# EAGLE design EnvironmentMonitorV5.1 (EAGLE 7.4.0)
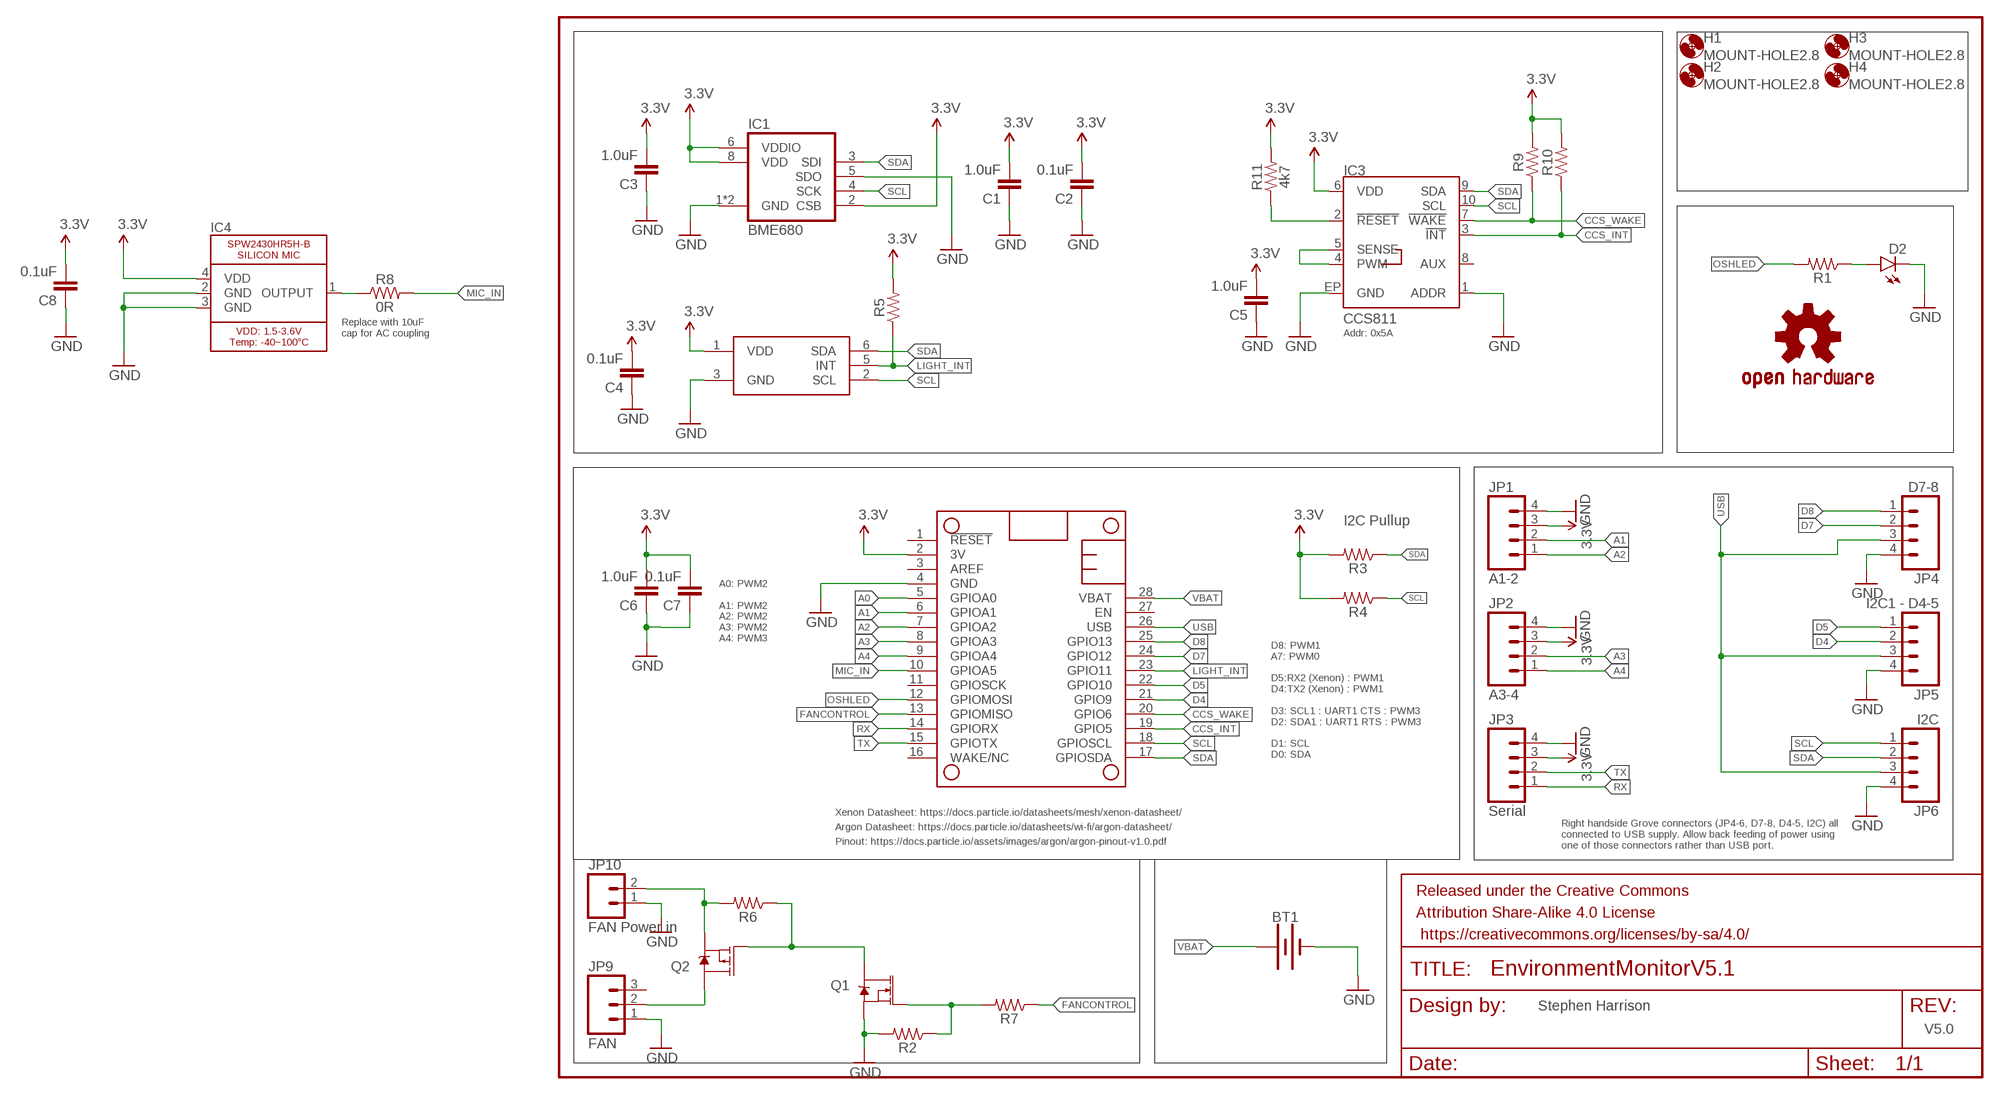
[diagram p0: schematic, sheet 1]

## Parts
BT1  BATTERY-16340  [BATTERY_16340-HOLDER]
C1  1.0uF  1.0UF-25V-+80/-20(0805)"  [0805-CAP]
C2  0.1uF  1.0UF-25V-+80/-20(0805)"  [0805-CAP]
C3  1.0uF  1.0UF-25V-+80/-20(0805)"  [0805-CAP]
C4  0.1uF  1.0UF-25V-+80/-20(0805)"  [0805-CAP]
C5  1.0uF  1.0UF-25V-+80/-20(0805)"  [0805-CAP]
C6  1.0uF  1.0UF-25V-+80/-20(0805)"  [0805-CAP]
C7  0.1uF  1.0UF-25V-+80/-20(0805)"  [0805-CAP]
C8  0.1uF  1.0UF-25V-+80/-20(0805)"  [0805-CAP]
D2  LED1206-BOTTOM  [LED-1206-BOTTOM]
FRAME1  FRAME-LETTER  [CREATIVE_COMMONS]
H1  MOUNT-HOLE2.8  [2,8]
H2  MOUNT-HOLE2.8  [2,8]
H3  MOUNT-HOLE2.8  [2,8]
H4  MOUNT-HOLE2.8  [2,8]
IC1  BME680  [BME680]
IC2  TCS3472  [FN-6]
IC3  CCS811  [LGA10]
IC4  SPW2430HR5H-B  [SPW2430HR5H-B]
IC5  FEATHERWING_NODIM  [FEATHERWING_DIM]
JP1  A1-2  M04JST-PTH-VERT  [JST-4-PTH-VERT]
JP2  A3-4  M04JST-PTH-VERT  [JST-4-PTH-VERT]
JP3  Serial  M04JST-PTH-VERT  [JST-4-PTH-VERT]
JP4  D7-8  M04JST-PTH-VERT  [JST-4-PTH-VERT]
JP5  I2C1 - D4-5  M04JST-PTH-VERT  [JST-4-PTH-VERT]
JP6  I2C  M04JST-PTH-VERT  [JST-4-PTH-VERT]
JP9  FAN  M03POLAR  [MOLEX-1X3]
JP10  FAN Power in  M02POLAR_LOCK  [MOLEX-1X2_LOCK]
LOGO1  OSHW-LOGOM  [OSHW-LOGO-M]
Q1  220mA/50V/3.5Ω  MOSFET-NCH-BSS138  [SOT23-3]
Q2  4.3A/20V/54mΩ  MOSFET_PCH-IRLML2244  [SOT23-3]
R1  RESISTOR0805  [0805]
R2  RESISTOR0805  [0805]
R3  RESISTOR0805  [0805]
R4  RESISTOR0805  [0805]
R5  RESISTOR0805  [0805]
R6  RESISTOR0805  [0805]
R7  RESISTOR0805  [0805]
R8  0R  RESISTOR0805  [0805]
R9  RESISTOR0805  [0805]
R10  RESISTOR0805  [0805]
R11  4k7  RESISTOR0805  [0805]

## Nets
3.3V: C1.2 C2.2 C3.2 C4.2 C5.2 C6.2 C7.2 C8.2 IC1.2(CSB) IC1.6(VDDIO) IC1.8(VDD) IC2.1(VDD) IC3.6(VDD) IC4.4(VDD) IC5.2(3V) JP1.3 JP2.3 JP3.3 R3.2 R4.2 R5.2 R9.2 R10.2 R11.2
A0: IC5.5(GPIOA0)
A1: IC5.6(GPIOA1) JP1.2
A2: IC5.7(GPIOA2) JP1.1
A3: IC5.8(GPIOA3) JP2.2
A4: IC5.9(GPIOA4) JP2.1
CCS8_RESET: IC3.2(!RESET!) R11.1
CCS_INT: IC3.3(!INT!) IC5.19(GPIO5) R10.1
CCS_WAKE: IC3.7(!WAKE!) IC5.20(GPIO6) R9.1
D4: IC5.21(GPIO9) JP5.2
D5: IC5.22(GPIO10) JP5.1
D7: IC5.24(GPIO12) JP4.2
D8: IC5.25(GPIO13) JP4.1
FANCONTROL: IC5.13(GPIOMISO) R7.1
GND: BT1.P$2(-) C1.1 C2.1 C3.1 C4.1 C5.1 C6.1 C7.1 C8.1 D2.C IC1.1(GND) IC1.5(SDO) IC1.7(GND) IC2.3(GND) IC3.1(ADDR) IC3.EP(GND) IC4.2(GND) IC4.3(GND) IC5.4(GND) JP1.4 JP2.4 JP3.4 JP4.4 JP5.4 JP6.4 JP9.1 JP10.1 Q1.2(S) R2.2
LIGHT_INT: IC2.5(INT) IC5.23(GPIO11) R5.1
MIC_IN: IC5.10(GPIOA5) R8.2
N$1: JP10.2 Q2.2(S) R6.2
N$2: Q1.3(D) Q2.1(G) R6.1
N$3: IC3.4(PWM) IC3.5(SENSE)
N$5: Q1.1(G) R2.1 R7.2
N$6: D2.A R1.1
N$7: IC4.1(OUTPUT) R8.1
N$8: JP9.2 Q2.3(D)
OSHLED: IC5.12(GPIOMOSI) R1.2
RX: IC5.14(GPIORX) JP3.1
SCL: IC1.4(SCK) IC2.2(SCL) IC3.10(SCL) IC5.18(GPIOSCL) JP6.1 R4.1
SDA: IC1.3(SDI) IC2.6(SDA) IC3.9(SDA) IC5.17(GPIOSDA) JP6.2 R3.1
TX: IC5.15(GPIOTX) JP3.2
USB: IC5.26(USB) JP4.3 JP5.3 JP6.3
VBAT: BT1.P$1(+) IC5.28(VBAT)
Unconnected: IC3.8(AUX) IC5.1(!RESET) IC5.3(AREF) IC5.11(GPIOSCK) IC5.16(WAKE/NC) IC5.27(EN) JP9.3

## Notes on the sheet
- Replace with 10uF 
  cap for AC coupling
- Addr: 0x5A
- I2C Pullup
- A0: PWM2
  
  A1: PWM2
  A2: PWM2
  A3: PWM2
  A4: PWM3
- D8: PWM1
  A7: PWM0
  
  D5:RX2 (Xenon) : PWM1
  D4:TX2 (Xenon) : PWM1
  
  D3: SCL1 : UART1 CTS : PWM3
  D2: SDA1 : UART1 RTS : PWM3
  
  D1: SCL
  D0: SDA
- Xenon Datasheet: https://docs.particle.io/datasheets/mesh/xenon-datasheet/
- Argon Datasheet: https://docs.particle.io/datasheets/wi-fi/argon-datasheet/
- Pinout: https://docs.particle.io/assets/images/argon/argon-pinout-v1.0.pdf
- Right handside Grove connectors (JP4-6, D7-8, D4-5, I2C) all 
  connected to USB supply. Allow back feeding of power using
  one of those connectors rather than USB port.
- Stephen Harrison
- V5.0

## Library data of the parts
BT1 = ThingySticks:BATTERY: Battery - Single Cell A variety of battery chemistries, sizes, and footprints. Device List: 20MM_PTH - Coin Cell Battery Holder - 20mm (PTH) <https://www.sparkfun.com/products/783> 12MM_SMD - Coin Cell Battery Holder - 12mm (SMD) <https://www.sparkfun.com/products/10592> 12MM_PTH - Coin Cell Battery Holder - 12mm (PTH) <https://www.sparkfun.com/products/7948> 20MM_SMD - 20mm Coin Cell Battery Holder (SMD) (2 legs) Used on the Big Time Watch Kit <https://www.sparkfun.com/products/11734> 20MM_SMD_4LEGS - Coin Cell Battery Holder - 20mm (SMD) <https://www.sparkfun.com/products/11892> 20MM_SMD_4LEGS_OVERPASTE - Coin Cell Battery Holder - 20mm (SMD) <https://www.sparkfun.com/products/11892> (Over-paste on the legs) 24.5MM_PTH - Coin Cell Battery Holder - 24.5mm (PTH) <https://www.sparkfun.com/products/8863> 9V - 9V Battery Holder - PC Mount Used on the SparkFun SparkPunk Sound Kit <https://www.sparkfun.com/products/11177> and SparkFun SparkPunk Sequencer Kit <https://www.sparkfun.com/products/12707> 18650 - Battery Holder - 18650 (PTH) <https://www.sparkfun.com/products/13113> AA - Battery Holder - 1xAA (PTH) <https://www.sparkfun.com/products/7949> AAA - Battery Holder - 1xAAA (PTH) <https://www.sparkfun.com/products/12718> AA_KIT - Battery Holder - 1xAA (PTH) <https://www.sparkfun.com/products/7949> Special kit package - pads only have exposed copper on one side of the board. AAA_KIT - Battery Holder - 1xAAA (PTH) <https://www.sparkfun.com/products/12718> Special kit package - pads only have exposed copper on one side of the board.
C1 C3 C5 C6 = SparkFun-Capacitors:1.0UF-25V-+80/-20(0805): CAP-11625; PROD_ID: CAP-11625
C2 C4 C7 C8 = SparkFun-Capacitors:1.0UF-25V-+80/-20(0805): CAP-11625; PROD_ID: CAP-11625; VALUE: 1.0uF
D2 = SparkFun-LED:LED: LEDs Standard schematic elements and footprints for 5mm, 3mm, 1206, and 0603 sized LEDs. 5mm - Spark Fun Electronics SKU : COM-00529 (and others)
FRAME1 = SparkFun-Aesthetics:FRAME-LETTER: Schematic Frame Standard 8.5x11 US Letter frame
H1-H4 = holes:MOUNT-HOLE: MOUNTING HOLE with drill center marker
IC1 = ThingySticks:BME680: BME680 integrates for the first time individual high linearity and high accuracy sensors for gas, pressure, humidity and temperature. The library has been designed by Richard Magdycz <https://www.facebook.com/groups/eaglecadsoftUK> Original version had pins in incorrect places (BME680 uses untypical clockwise direction). Updated 17 Feb 2018 S.Harrison ThingySticks.com
IC2 = TCS3472:TCS3472
IC3 = ThingySticks:CCS811: AMS CCS811 – I2C Digital Gas Sensor Ultra-Low Power Digital Gas Sensor for Monitoring Indoor Air Quality AMS Product Page <http://ams.com/eng/Products/Environmental-Sensors/Gas-Sensors/CCS811> SparkFun Products:; PROD_ID: IC-13607
IC4 = microbuilder:SPW2430HR5H-B: SPW2430HR5H-B - Silicon Microphone
IC5 = ThingySticks:FEATHERWING
JP1 = SparkFun-Connectors:M04: Header 4 Standard 4-pin 0.1" header. Use with straight break away headers (SKU : PRT-00116), right angle break away headers (PRT-00553), swiss pins (PRT-00743), machine pins (PRT-00117), and female headers (PRT-00115). Molex polarized connector foot print use with SKU : PRT-08231 with associated crimp pins and housings. 1MM SMD Version SKU: PRT-10208; CPC: MK00368; SEEEDSTUDIO: 110990030
JP2-JP6 = SparkFun-Connectors:M04: Header 4 Standard 4-pin 0.1" header. Use with straight break away headers (SKU : PRT-00116), right angle break away headers (PRT-00553), swiss pins (PRT-00743), machine pins (PRT-00117), and female headers (PRT-00115). Molex polarized connector foot print use with SKU : PRT-08231 with associated crimp pins and housings. 1MM SMD Version SKU: PRT-10208
JP9 = SparkFun-Connectors:M03: Header 3 Standard 3-pin 0.1" header. Use with straight break away headers (SKU : PRT-00116), right angle break away headers (PRT-00553), swiss pins (PRT-00743), machine pins (PRT-00117), and female headers (PRT-00115). Molex polarized connector foot print use with SKU : PRT-08232 with associated crimp pins and housings.
JP10 = SparkFun-Connectors:M02: Standard 2-pin 0.1" header. Use with - straight break away headers ( PRT-00116) - right angle break away headers (PRT-00553) - swiss pins (PRT-00743) - machine pins (PRT-00117) - female headers (PRT-00115) Molex polarized connector foot print use with: PRT-08233 with associated crimp pins and housings. 2.54_SCREWTERM for use with PRT-10571. 3.5mm Screw Terminal footprints for PRT-08084 5mm Screw Terminal footprints for use with PRT-08432
LOGO1 = SparkFun-Aesthetics:OSHW-LOGO: Open Source Hardware Logo This logo indicates the piece of hardware it is found on incorporates a OSHW license and/or adheres to the definition of open source hardware found here: http://freedomdefined.org/OSHW
Q1 = SparkFun-DiscreteSemi:MOSFET-NCH: N-channel MOSFETs Voltage controlled devices that allow control of high current outputs. SparkFun Products: SparkFun OpenScale <https://www.sparkfun.com/products/13261> SparkFun Digital Sandbox <https://www.sparkfun.com/products/12651> SparkFun Monster Moto Shield <https://www.sparkfun.com/products/10182> SparkFun MOSFET Power Controller <https://www.sparkfun.com/products/11214>; PROD_ID: TRANS-00830
Q2 = SparkFun-DiscreteSemi:MOSFET_PCH: P-channel MOSFETs Voltage controlled devices that allow control of high current outputs. SparkFun Products: SparkFun ESP32 Thing <https://www.sparkfun.com/products/13907> SparkFun ESP8266 Thing <https://www.sparkfun.com/products/13231>; PROD_ID: TRANS-11153
R1-R11 = SparkFun-Resistors:RESISTOR: Generic Resistor Package

## Board
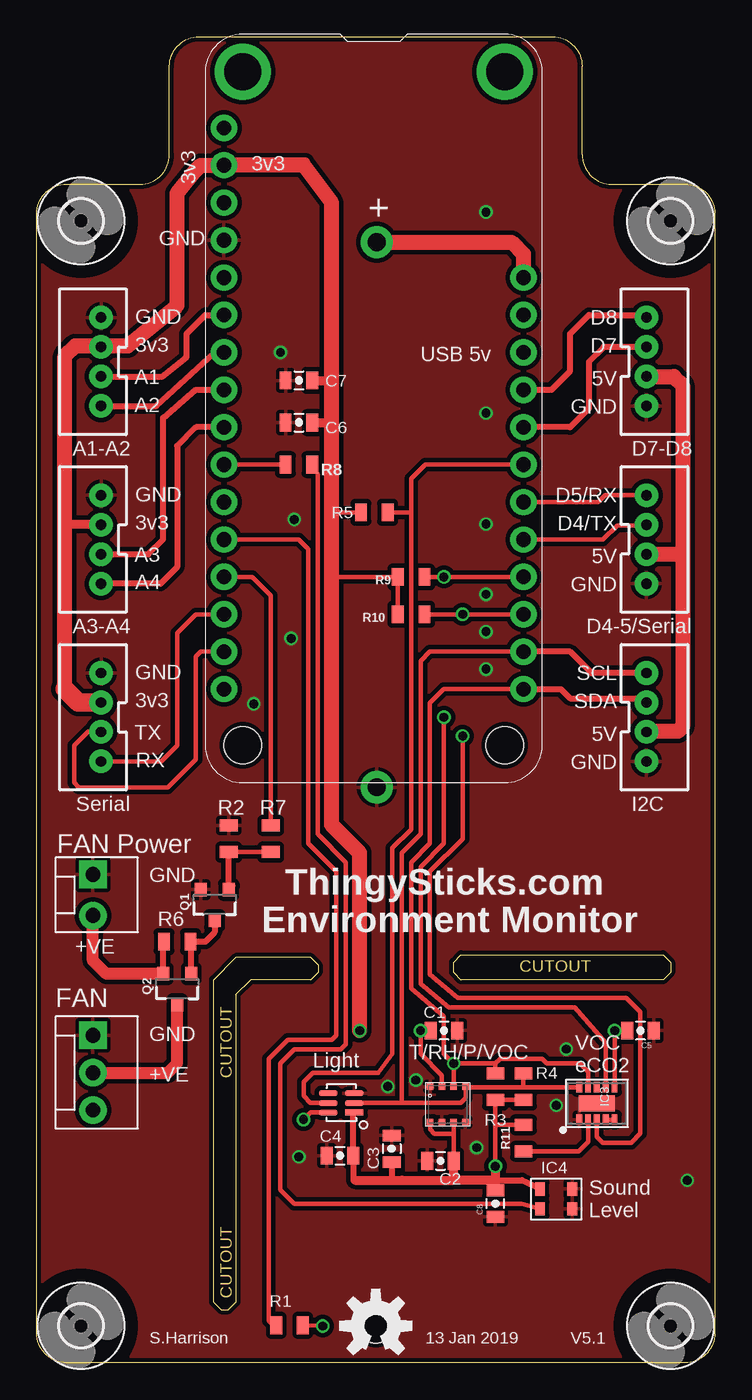
[diagram p1: board, top side]
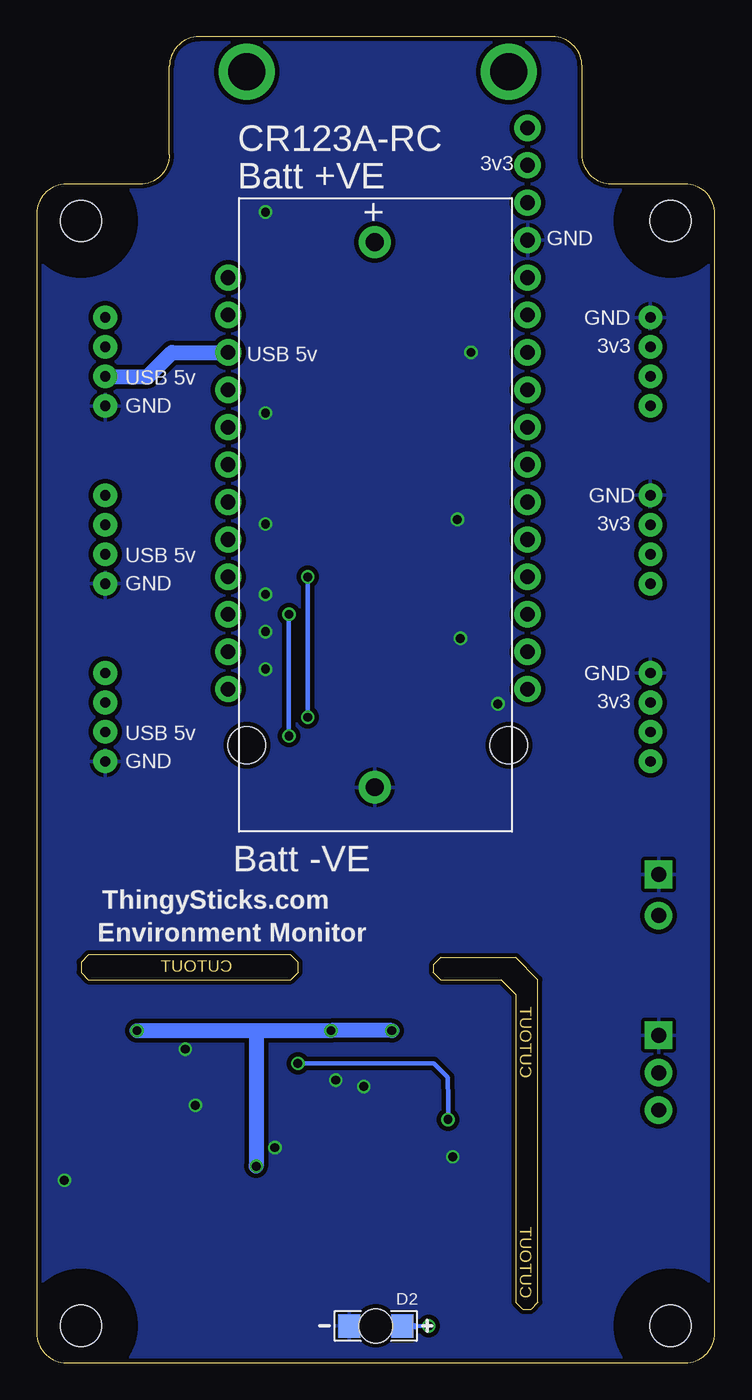
[diagram p2: board, bottom side, seen from below]

Size 46 x 90 mm. Coordinates in mm from the lower left corner, seen from the top.
Outline: 0,2 0,78 arc-90 2,80 7,80 arc90 9,82 9,88 arc-90 11,90 35,90 arc-90 37,88 37,82 arc90 39,80 44,80 arc-90 46,78 46,2 arc-90 44,0 2,0 arc-90 0,2
Outline: 12,4.1 12,26 13.5,27.5 18.59,27.5 19.09,27 19.09,26.5 18.59,26 14.5,26 13.5,25 13.5,4.1 13,3.6 12.5,3.6 12,4.1
Outline: 28.78,27.68 42.5,27.68 43,27.18 43,26.5 42.5,26 28.78,26 28.28,26.5 28.28,27.18 28.78,27.68
Copper layers (1*16): Top 0.035mm / dielectric 1.5mm / Bottom 0.035mm
Design rules "dirt_cheap_dirty_boards.v1": minimum track width 5mil, minimum drill 12mil, track to track 5mil, track to pad 5mil, pad to pad 5mil, via to via 5mil, smd to smd 0mil, copper to edge 10mil, drill to drill 10mil, minimum pad ring 10mil, minimum via ring 6mil, stop-mask expansion 2mil, vias tented up to drill 25mil, thermal gap 10mil

### Footprints (pad centres in the part's own frame; a part is rotated, then mirrored left to right if it is on the bottom)
BATTERY_16340-HOLDER = drill 1.2 pad 2.184: P$1 3,9.2; P$2 40,9.2
0805-CAP = smd 0.8 x 1.2: 1 -0.9,0; 2 0.9,0
LED-1206-BOTTOM = smd 1.5 x 1.6: A -1.8,0; C 1.8,0 | hole 2.3: 0,0
2,8 = hole 2.8: 0,0
BME680 = smd 0.45 x 0.45: 1 1.2,-1.2; 2 0.4,-1.2; 3 -0.4,-1.2; 4 -1.2,-1.2; 5 -1.2,1.2; 6 -0.4,1.2; 7 0.4,1.2; 8 1.2,1.2
FN-6 = smd 1.25 x 0.4: 1 -0.875,0.65; 2 -0.875,0; 3 -0.875,-0.65; 4 0.875,-0.65; 5 0.875,0; 6 0.875,0.65
LGA10 = smd 0.7 x 0.4: 1 -1.1,1.2; 2 -1.1,0.6; 3 -1.1,0; 4 -1.1,-0.6; 5 -1.1,-1.2; 6 1.1,-1.2; 7 1.1,-0.6; 8 1.1,0; 9 1.1,0.6; 10 1.1,1.2 | smd 1.1 x 2.45: EP 0,0
SPW2430HR5H-B = smd 0.9 x 0.66: 1 -0.675,1.095; 2 -0.675,-1.095; 3 0.675,-1.095; 4 0.675,1.095
FEATHERWING_DIM = drill 1 pad 1.778: 1 6.35,1.27; 2 8.89,1.27; 3 11.43,1.27; 4 13.97,1.27; 5 16.51,1.27; 6 19.05,1.27; 7 21.59,1.27; 8 24.13,1.27; 9 26.67,1.27; 10 29.21,1.27; 11 31.75,1.27; 12 34.29,1.27; 13 36.83,1.27; 14 39.37,1.27; 15 41.91,1.27; 16 44.45,1.27; 17 44.45,21.59; 18 41.91,21.59; 19 39.37,21.59; 20 36.83,21.59; 21 34.29,21.59; 22 31.75,21.59; 23 29.21,21.59; 24 26.67,21.59; 25 24.13,21.59; 26 21.59,21.59; 27 19.05,21.59; 28 16.51,21.59 | drill 2.5 pad 3.81: P$1 2.54,20.32; P$2 2.54,2.54 | hole 2.54: 48.26,20.32; 48.26,2.54
JST-4-PTH-VERT = drill 0.7 pad 1.6: 1 -3,-0.55; 2 -1,-0.55; 3 1,-0.55; 4 3,-0.55
MOLEX-1X3 = drill 1.016 pad 1.88 square: 1 0,0 | drill 1.016 pad 1.88: 2 2.54,0; 3 5.08,0
MOLEX-1X2_LOCK = drill 1.016 pad 1.88 square: 1 -0.127,0 | drill 1.016 pad 1.88: 2 2.667,0
SOT23-3 = smd 0.8 x 0.9: 1 -0.95,-1; 2 0.95,-1; 3 0,1.1
0805 = smd 0.8 x 1.2: 1 -0.9,0; 2 0.9,0

### Placement (x,y rotation side)
BT1  32.27,79.06 270 bottom
C1  27.62,22.54 180 top
C2  27.39,13.7 0 top
C3  24.08,14.52 270 top
C4  20.57,14.05 0 top
C5  40.96,22.54 180 top
C6  17.78,63.82 0 top
C7  17.78,66.67 0 top
C8  31.11,10.79 90 top
D2  23,2.5 180 bottom
FRAME1  -2.54,-23.5 0 top  (outside the outline)
H1  3,2.5 0 top
H2  3,77.5 0 top
H3  43,2.5 0 top
H4  43,77.5 0 top
IC1  27.89,17.53 180 top
IC2  20.66,17.64 180 top
IC3  38,17.6 90 top
IC4  35.24,11.11 90 top
IC5  11.43,90.17 270 top
JP1  3.81,67.94 90 top
JP2  3.81,55.88 90 top
JP3  3.81,43.81 90 top
JP4  41.91,67.94 270 top
JP5  41.91,55.88 270 top
JP6  41.91,43.81 270 top
JP9  3.81,22.23 270 top
JP10  3.81,33.02 270 top
LOGO1  23,2.5 0 top
Q1  12.06,31.11 180 top
Q2  9.53,25.4 180 top
R1  17.14,2.54 180 top
R2  13.02,35.56 90 top
R3  31.11,18.73 270 top
R4  33.02,18.73 270 top
R5  22.9,57.72 180 top
R6  9.53,28.57 180 top
R7  15.88,35.56 270 top
R8  17.78,60.96 180 top
R9  25.4,53.34 180 top
R10  25.4,50.8 180 top
R11  33.02,15.24 90 top

### Tracks (layer width: path | path; a pad name or v marks a point on that pad's centre or on a via)
3.3V  (via drill 0.6)
  Top 0.305: 27.43,18.78 IC1.2 27.48,19.5 26.04,20.95 26.04,22.49 C1.2 | C2.2 28.29,15.54 | 28.29,15.54 IC1.6 | IC1.8 26.68,15.84 26.98,15.54 28.29,15.54 | 31.11,16.19 R3.2 R4.2 | 31.11,16.19 v31.11,13.34 | IC3.6 39.2,22.38 v39.2,22.54 C5.2 | R11.2 31.17,16.14 31.11,16.19 | R10.2 R9.2 20,53.34 | R5.2 20.39,57.72 20,62.23
  Top 0.406: IC2.1 21.48,16.92 C4.2 21.48,12.5 21.59,12.38 | C3.2 24.08,12.43 24.77,12.38 | C1.2 v26.04,22.54 | 31.11,12.38 32.92,12.38 IC4.4
  Top 0.61: 21.59,12.38 24.77,12.38 28.26,12.38 | JP2.3 2.02,56.88 1.91,57 | 18.22,81.5 18,81.28 | C6.2 20,63.82 | C7.2 20,66.67 | v31.11,13.34 31.11,12.38 | 31.11,12.38 C8.2 | 31.11,12.38 28.26,12.38 | C2.2 28.26,13.7 28.26,12.38
  Top 1.016: 1.91,45.72 1.91,57 1.91,68.35 2.59,69.04 4.27,69.04 | 4.27,69.04 JP1.3 | 4.27,69.04 6.17,69.04 9.53,71.75 9.53,79.38 10.79,80.96 11.11,81.28 IC5.2 18,81.28 18.1,81.28 20,78.74 20,66.67 20,63.82 20,62.23 20,53.34 20,36.51 21.91,34.61 v21.91,22.54
  Top 1.27: JP3.3 2.81,44.81 1.91,45.72
  Bottom 1.016: v39.2,22.54 31.11,22.54 | 31.11,22.54 v26.04,22.54 v21.91,22.54 | 31.11,22.54 v31.11,13.34
A1
  Top 0.406: JP1.2 8.53,66.94 10.16,68.26 10.16,69.85 11.43,71.12 IC5.6
A2
  Top 0.406: JP1.1 8.11,64.94 12.06,68.58 IC5.7
A3
  Top 0.406: JP2.2 7.57,54.88 8.57,55.88 8.57,64.14 10.79,66.04 IC5.8
A4
  Top 0.406: IC5.9 10.79,63.5 9.53,62.23 9.53,54 8.41,52.88 JP2.1
CCS8_RESET
  Top 0.305: IC3.2 37.41,14.98 36.76,14.34 R11.1
CCS_INT  (via drill 0.6)
  Top 0.305: IC3.3 38.01,15.34 38.42,14.92 40.32,14.92 40.96,15.56 40.96,23.81 40.01,24.77 28.57,24.77 26.67,26.35 26.67,33.34 28.89,35.56 v28.89,42.55 | R10.1 v28.89,50.8 IC5.19
  Bottom 0.305: v28.89,42.55 v28.89,50.8
CCS_WAKE  (via drill 0.6)
  Top 0.305: IC3.7 38.6,21.72 36.51,24.13 27.94,24.13 26.04,25.72 26.04,33.66 27.62,35.24 v27.62,43.81 | R9.1 v27.62,53.34 IC5.20
  Bottom 0.305: v27.62,43.81 v27.62,53.34
D4
  Top 0.305: IC5.21 38.42,55.88 39.37,56.83 41.31,56.83 JP5.2
D5
  Top 0.305: JP5.1 38.56,58.88 38.1,58.42 IC5.22
D7
  Top 0.406: JP4.2 38.47,68.94 37.47,67.94 37.47,64.77 36.2,63.5 IC5.24
D8
  Top 0.406: IC5.25 34.92,66.04 36.2,67.31 36.2,69.85 37.47,71.12 41.19,71.12 JP4.1
FANCONTROL
  Top 0.305: R7.1 15.88,52.07 14.61,53.34 IC5.13
GND  (via drill 0.6)
  other vias: 17.78,13.97 25.72,19.18 44.13,12.38 30.48,64.45 23.81,18.75 16.54,68.58 30.48,47.08 14.72,44.72 30.48,78.11 30.48,52.16 29.84,14.61 17.26,49.17 35.93,21.29 30.48,56.92 17.46,57.24 35.24,17.46 30.48,49.62
  pour Bottom (isolate 0.305, rank 6): 46.52,91.19 46.62,-1.44 -0.94,-1.44 -0.73,91.19
  pour Top (isolate 0.305, rank 6): -0.73,91.19 46.52,91.15 46.62,-1.47 -0.94,-1.44
LIGHT_INT
  Top 0.305: IC2.5 18.56,17.64 18.1,18.1 18.1,19.05 18.73,19.68 23.18,19.68 24.13,20.95 24.13,34.92 25.4,36.2 25.4,57.47 25.4,57.72 | 25.4,57.72 25.4,60.01 26.35,60.96 IC5.23 | R5.1 25.4,57.72
MIC_IN
  Top 0.305: IC5.10 R8.2
N$1
  Top 0.406: Q2.2 8.57,28.52 R6.2
  Top 0.813: Q2.2 4.71,26.4 3.81,27.3 JP10.2
N$2
  Top 0.406: Q2.1 10.47,28.52 R6.1 11.43,28.57 12.06,29.21 Q1.3
N$3
  Top 0.305: IC3.4 IC3.5
N$5
  Top 0.305: R7.2 R2.1
  Top 0.406: 13.29,32.38 Q1.1 13.02,34.87 R2.1
N$6  (via drill 0.6)
  Top 0.305: R1.1 19.43,2.52
  Top 0.406: 19.43,2.52 v19.41,2.49
  Bottom 0.305: v19.41,2.49 20.32,2.47
  Bottom 0.406: 20.32,2.47 D2.A
N$7
  Top 0.305: R8.1 19.05,60.33 19.05,35.88 20.95,33.97 20.95,21.59 20.64,21.27 17.46,21.27 16.51,20.32 16.51,11.75 17.46,10.79 32.92,10.79 IC4.1
N$8
  Top 0.813: JP9.2 8.89,19.68 9.53,20.32 Q2.3
OSHLED
  Top 0.305: R1.2 16.06,2.54 15.74,2.86 15.74,20.64 17.01,21.91 20,21.91 20.32,22.23 20.32,33.34 18.41,35.24 18.41,55.24 17.78,55.88 IC5.12
RX
  Top 0.305: JP3.1 8.43,40.81 9.53,41.91 9.53,49.53 10.79,50.8 IC5.14
SCL
  Top 0.305: 24.77,17.64 24.77,34.61 26.04,35.88 26.04,47.62 26.67,48.26 IC5.18 | IC3.10 33.02,18.69 | 33.02,18.69 29.12,18.69 IC1.4 29.11,18.71 29.11,17.98 28.76,17.64 24.77,17.64 | IC2.2 24.77,17.64 | R4.1 33.02,18.69
  Top 0.406: JP6.1 37.64,46.81 36.2,48.26 IC5.18
SDA  (via drill 0.6)
  Top 0.305: IC5.17 27.62,45.72 26.67,44.77 26.67,35.24 25.4,33.97 25.4,25.4 27.62,23.5 27.62,20.95 28.29,20.29 IC1.3 | IC2.6 18.57,16.98 v18.1,16.51 | IC3.9 37.41,19.75 36.83,20.32 34.61,20.32 34.29,20.64 31.43,20.64 31.11,20.32 | 31.11,20.32 v28.29,20.32 | R3.1 31.11,20.32
  Top 0.406: IC5.17 35.56,45.72 36.2,45.09 41.09,45.09 JP6.2 | 28.29,20.29 v28.29,20.32
  Bottom 0.305: v18.1,16.51 18.1,17.78 18.13,19.37 19.08,20.32 v28.29,20.32
TX
  Top 0.305: JP3.2 4.41,42.86 3.49,42.86 2.54,41.91 2.54,39.37 2.86,39.05 8.89,39.05 10.79,40.96 10.79,47.94 11.11,48.26 IC5.15
  Top 0.406: 4.35,42.82 JP3.2
USB
  Top 1.016: JP4.3 43.23,66.94 43.81,66.36 43.81,54.93 | 43.81,54.93 43.81,43.18 43.5,42.86 41.41,42.86 JP6.3 | JP5.3 43.77,54.88 43.81,54.93
  Bottom 1.016: JP4.3 38.47,66.94 36.83,68.58 IC5.26
VBAT
  Top 1.016: BT1.P$1 32.21,76.06 33.02,75.25 IC5.28

### Text on the board
Dimension: CUTOUT | CUTOUT | CUTOUT
tNames: 3v3 | 3v3 | GND | D8 | GND | D7 | 3v3 | USB 5v | 5V | A1 | GND | A2 | A1-A2 | D7-D8 | D5/RX | GND | 3v3 | D4/TX | 5V | A3 | GND | A4 | A3-A4 | D4-5/Serial | SCL | GND | SDA | 3v3 | 5V | TX | GND | RX | Serial | I2C | FAN Power | GND | ThingySticks.com | Environment Monitor | +VE | FAN | GND | T/RH/P/VOC | Light | VOC / eCO2 | +VE | Sound / Level | V5.1 | S.Harrison | 13 Jan 2019
bNames: 3v3 | CR123A-RC | Batt +VE | GND | GND | 3v3 | USB 5v | USB 5v | GND | GND | 3v3 | USB 5v | GND | GND | 3v3 | USB 5v | GND | Batt -VE | ThingySticks.com | Environment Monitor